# Altium schematic sheet Bottom_Res.SchDoc
size A4; SheetNumber: 7; SheetTotal: 7
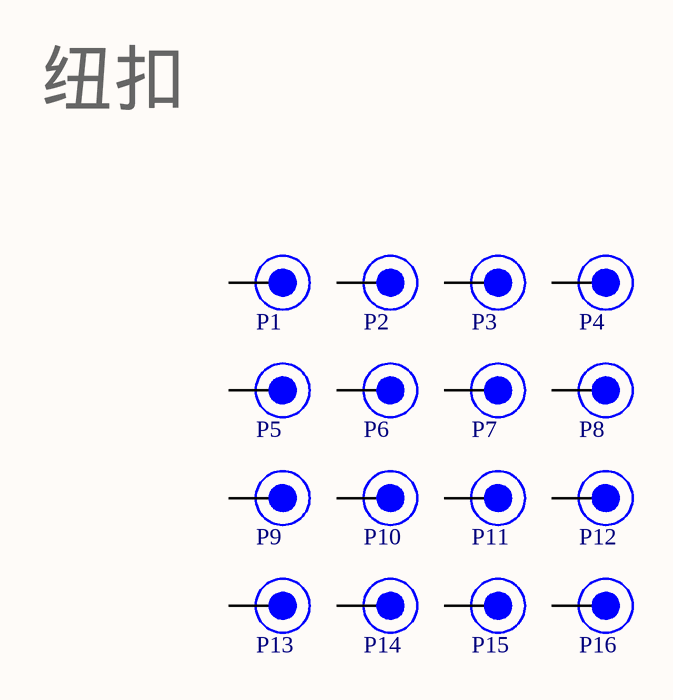
[diagram p0: Bottom_Res.SchDoc]

## Parts
P1  11mm Pad  [11mm Pad]  (value not drawn)
P2  11mm Pad  [11mm Pad]  (value not drawn)
P3  11mm Pad  [11mm Pad]  (value not drawn)
P4  11mm Pad  [11mm Pad]  (value not drawn)
P5  11mm Pad  [11mm Pad]  (value not drawn)
P6  11mm Pad  [11mm Pad]  (value not drawn)
P7  11mm Pad  [11mm Pad]  (value not drawn)
P8  11mm Pad  [11mm Pad]  (value not drawn)
P9  11mm Pad  [11mm Pad]  (value not drawn)
P10  11mm Pad  [11mm Pad]  (value not drawn)
P11  11mm Pad  [11mm Pad]  (value not drawn)
P12  11mm Pad  [11mm Pad]  (value not drawn)
P13  11mm Pad  [11mm Pad]  (value not drawn)
P14  11mm Pad  [11mm Pad]  (value not drawn)
P15  11mm Pad  [11mm Pad]  (value not drawn)
P16  11mm Pad  [11mm Pad]  (value not drawn)

## Nets

Not connected (* = marked no-connect by the designer): P1 1; P2 1; P3 1; P4 1; P5 1; P6 1; P7 1; P8 1; P9 1; P10 1; P11 1; P12 1; P13 1; P14 1; P15 1; P16 1

## Notes on the sheet
- 纽扣

## Library data of the parts
P1-P16 = 11mm Pad: TestPad_SMD